# Altium schematic sheet 13-Counter74LS90.SchDoc
size A4; DocumentNumber: 13; SheetNumber: 13; SheetTotal: 26
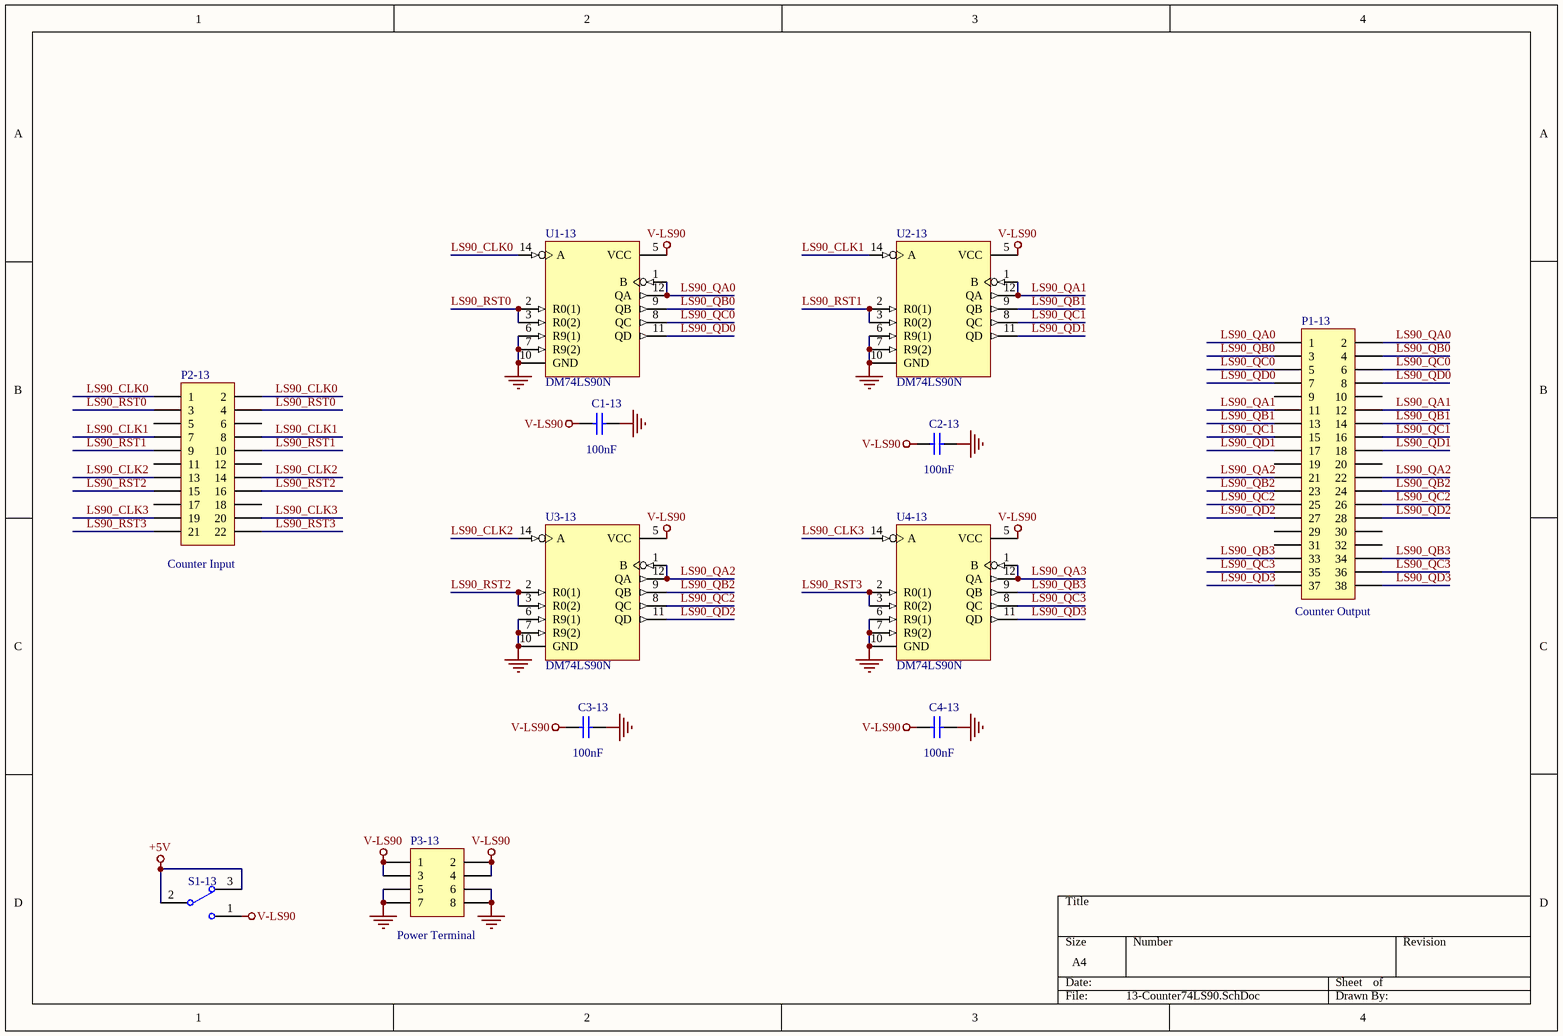
[diagram p0: 13-Counter74LS90.SchDoc]

## Parts
C1-13  value 100nF  [c-0805]  (hidden comment: 104)
C2-13  value 100nF  [c-0805]  (hidden comment: 104)
C3-13  value 100nF  [c-0805]  (hidden comment: 104)
C4-13  value 100nF  [c-0805]  (hidden comment: 104)
P1-13  value Counter Output  [JP2.54-F-2x19A]  (hidden comment: Header 19X2)
P2-13  value Counter Input  [JP2.54-F-2x11A]  (hidden comment: Header 11X2)
P3-13  Publisher: Power Terminal  [JP2.54-F-2x04A]  (hidden comment: Header 4X2)
S1-13  SW-SPDT  [SW-SLIDE-2P-2W]  (value not drawn)
U1-13  DM74LS90N  [SK-DIP14-300]
U2-13  DM74LS90N  [SK-DIP14-300]
U3-13  DM74LS90N  [SK-DIP14-300]
U4-13  DM74LS90N  [SK-DIP14-300]

## Nets
+5V: S1-13.2 S1-13.3
GND: C1-13.2 C2-13.2 C3-13.2 C4-13.2 P3-13.5 P3-13.6 P3-13.7 P3-13.8 U1-13.6(R9(1)) U1-13.7(R9(2)) U1-13.10(GND) U2-13.6(R9(1)) U2-13.7(R9(2)) U2-13.10(GND) U3-13.6(R9(1)) U3-13.7(R9(2)) U3-13.10(GND) U4-13.6(R9(1)) U4-13.7(R9(2)) U4-13.10(GND)
V-LS90: C1-13.1 C2-13.1 C3-13.1 C4-13.1 P3-13.1 P3-13.2 P3-13.3 P3-13.4 S1-13.1 U1-13.5(VCC) U2-13.5(VCC) U3-13.5(VCC) U4-13.5(VCC)
LS90_CLK0: P2-13.1 P2-13.2 U1-13.14(A)
LS90_CLK1: P2-13.7 P2-13.8 U2-13.14(A)
LS90_CLK2: P2-13.13 P2-13.14 U3-13.14(A)
LS90_CLK3: P2-13.19 P2-13.20 U4-13.14(A)
LS90_QA0: P1-13.1 P1-13.2 U1-13.1(B) U1-13.12(QA)
LS90_QA1: P1-13.11 P1-13.12 U2-13.1(B) U2-13.12(QA)
LS90_QA2: P1-13.21 P1-13.22 U3-13.1(B) U3-13.12(QA)
LS90_QA3: U4-13.1(B) U4-13.12(QA)
LS90_QB0: P1-13.3 P1-13.4 U1-13.9(QB)
LS90_QB1: P1-13.13 P1-13.14 U2-13.9(QB)
LS90_QB2: P1-13.23 P1-13.24 U3-13.9(QB)
LS90_QB3: P1-13.33 P1-13.34 U4-13.9(QB)
LS90_QC0: P1-13.5 P1-13.6 U1-13.8(QC)
LS90_QC1: P1-13.15 P1-13.16 U2-13.8(QC)
LS90_QC2: P1-13.25 P1-13.26 U3-13.8(QC)
LS90_QC3: P1-13.35 P1-13.36 U4-13.8(QC)
LS90_QD0: P1-13.7 P1-13.8 U1-13.11(QD)
LS90_QD1: P1-13.17 P1-13.18 U2-13.11(QD)
LS90_QD2: P1-13.27 P1-13.28 U3-13.11(QD)
LS90_QD3: P1-13.37 P1-13.38 U4-13.11(QD)
LS90_RST0: P2-13.3 P2-13.4 U1-13.2(R0(1)) U1-13.3(R0(2))
LS90_RST1: P2-13.9 P2-13.10 U2-13.2(R0(1)) U2-13.3(R0(2))
LS90_RST2: P2-13.15 P2-13.16 U3-13.2(R0(1)) U3-13.3(R0(2))
LS90_RST3: P2-13.21 P2-13.22 U4-13.2(R0(1)) U4-13.3(R0(2))

Not connected (* = marked no-connect by the designer): P1-13 9 10 19 20 29 30 31 32; P2-13 5 6 11 12 17 18

## Library data of the parts
C1-13 C2-13 C3-13 C4-13 = Cap: Capacitor; Published: 8-Jun-2000; LatestRevisionDate: 17-Jul-2002; LatestRevisionNote: Re-released for DXP Platform.; PackageReference: RAD-0.3; Publisher: Altium Limited; PackageDescription: Radial Cap, Thru-Hole; 2 Leads; 0.3 in Pin Spacing
P1-13 = Header 19X2: Header, 19-Pin, Dual row; LatestRevisionDate: 17-Jul-2002; LatestRevisionNote: Re-released for DXP Platform.
P2-13 = Header 11X2: Header, 11-Pin, Dual row; LatestRevisionDate: 17-Jul-2002; LatestRevisionNote: Re-released for DXP Platform.
P3-13 = Header 4X2: Header, 4-Pin, Dual row; LatestRevisionDate: 17-Jul-2002; LatestRevisionNote: Re-released for DXP Platform.
S1-13 = SW-SPDT: SPDT Subminiature Toggle Switch, Right Angle Mounting, Vertical Actuation; Published: 24-Mar-1999; LatestRevisionDate: 17-Dec-2003; LatestRevisionNote: Schematic revised, PCB Footprint replaced.; DatasheetVersion: 05-Dec-2000; PackageReference: TL36WW15050; Publisher: Altium Limited; PackageDescription: Switch; 4 Leads; ComponentLink1Description: Manufacturer Link; ComponentLink1URL: http://www.apem.com
U1-13 U2-13 U3-13 U4-13 = DM74LS90N: Decade and Binary Counter; Note: NC pins 4 and 13 are not drawn.; Published: 17-Jul-2002; LatestRevisionDate: 29-May-2009; LatestRevisionNote: Component Body Added.; DatasheetVersion: Mar-1998; PackageVersion: 2000; PackageReference: N14A; Publisher: Altium Limited; PackageDescription: DIP, 14-Pin, Row Spacing 7.62 mm, Pitch 2.54 mm; ComponentLink1Description: Manufacturer Link; ComponentLink1URL: http://www.fairchildsemi.com/